# EAGLE design GpsTracker_v1.0 (EAGLE 6.6.0)
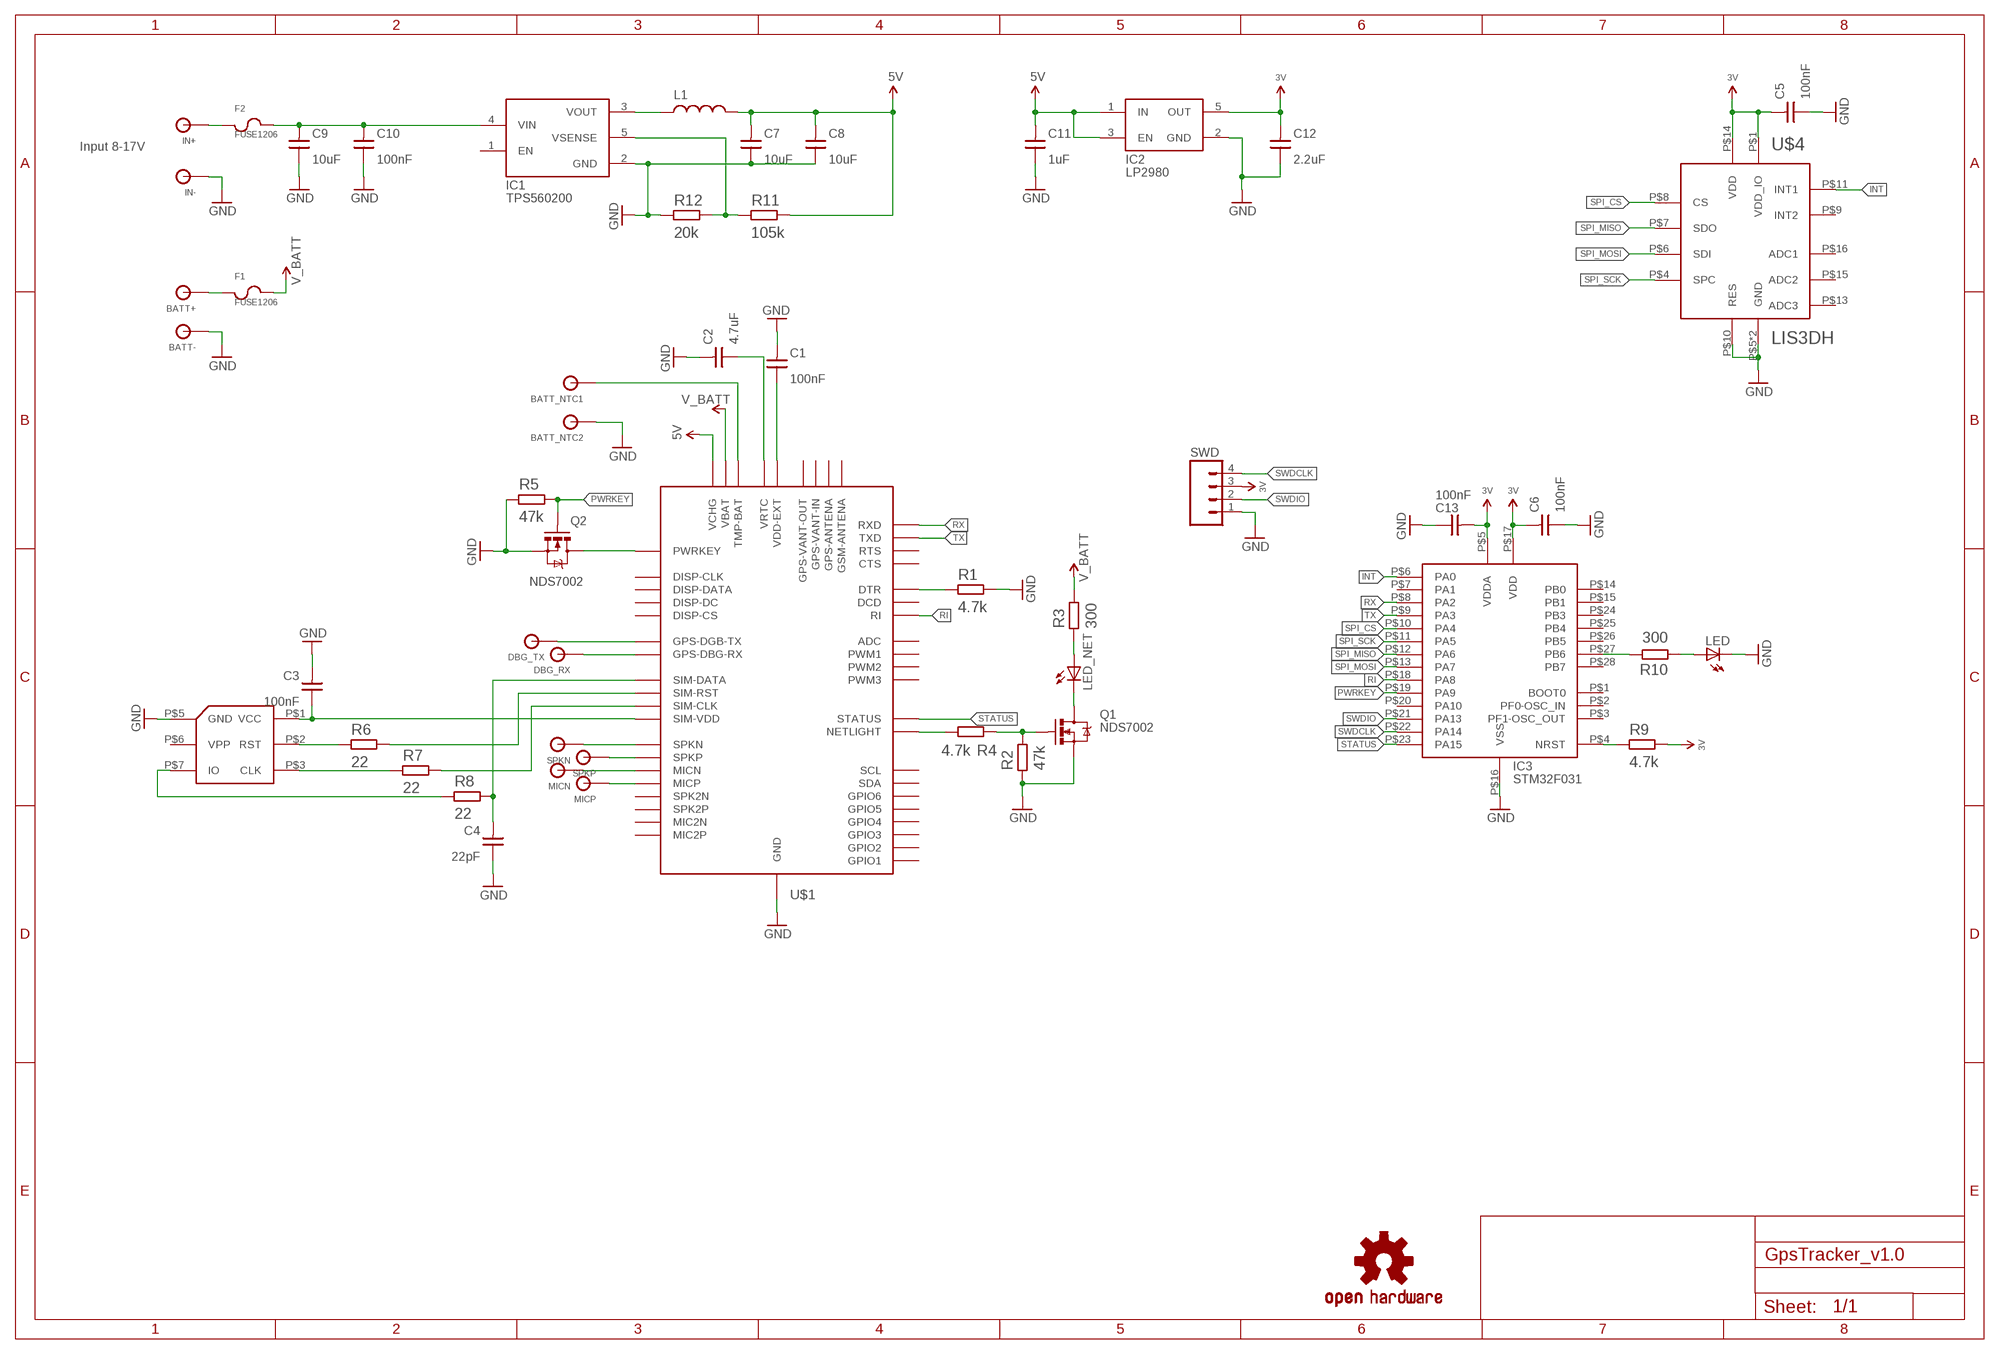
[diagram p0: schematic, sheet 1]

## Parts
BATT+  TEST_POINT_SMD  [TEST_POINT_SMD]
BATT-  TEST_POINT_SMD  [TEST_POINT_SMD]
BATT_NTC1  TEST_POINT_R04  [TP_R04]
BATT_NTC2  TEST_POINT_R04  [TP_R04]
C1  100nF  C0603  [R0603]
C2  4.7uF  C0805  [R0805]
C3  100nF  C0603  [R0603]
C4  22pF  C0603  [R0603]
C5  100nF  C0603  [R0603]
C6  100nF  C0603  [R0603]
C7  10uF  C0805  [R0805]
C8  10uF  C0805  [R0805]
C9  10uF  C1206  [1206]
C10  100nF  C0603  [R0603]
C11  1uF  C0805  [R0805]
C12  2.2uF  C0805  [R0805]
C13  100nF  C0603  [R0603]
DBG_RX  TEST_POINT_R04  [TP_R04]
DBG_TX  TEST_POINT_R04  [TP_R04]
F1  FUSE1206  [1206]
F2  FUSE1206  [1206]
IC1  TPS560200  [SOT23-5L]
IC2  LP2980  [SOT23-5L]
IC3  STM32F031  [UFQFPN28]
IN+  TEST_POINT_SMD  [TEST_POINT_SMD]
IN-  TEST_POINT_SMD  [TEST_POINT_SMD]
L1  LNRG_4026  [NRG_4026]
LED  LED0603  [LED-0603]
LED_NET  LED0603  [LED-0603]
LOGO1  OSHW-LOGOS  [OSHW-LOGO-S]
MICN  TEST_POINT_R04  [TP_R04]
MICP  TEST_POINT_R04  [TP_R04]
Q1  NDS7002  [SOT23]
Q2  NDS7002  [SOT23]
R1  4.7k  R0603  [R0603]
R2  47k  R0603  [R0603]
R3  300  R0603  [R0603]
R4  4.7k  R0603  [R0603]
R5  47k  R0603  [R0603]
R6  22  R0603  [R0603]
R7  22  R0603  [R0603]
R8  22  R0603  [R0603]
R9  4.7k  R0603  [R0603]
R10  300  R0603  [R0603]
R11  105k  R0603  [R0603]
R12  20k  R0603  [R0603]
SPKN  TEST_POINT_R04  [TP_R04]
SPKP  TEST_POINT_R04  [TP_R04]
SWD  M041.27MM  [1X04-1.27MM]
U$1  SIM908  [SIM908]
U$3  SIM_CARD  [SIM_SAMSUNG]
U$4  LIS3DH  [LGA16D]

## Nets
3V: C5.2 C6.2 C12.2 C13.2 IC2.5(OUT) IC3.P$5(VDDA) IC3.P$17(VDD) R9.2 SWD.3 U$4.P$1(VDD_IO) U$4.P$14(VDD)
5V: C7.2 C8.2 C11.2 IC2.1(IN) IC2.3(EN) L1.P$2 R11.2 U$1.VCHG
GND: BATT-.P$1 BATT_NTC2.P$1 C1.2 C2.2 C3.2 C4.1 C5.1 C6.1 C7.1 C8.1 C9.1 C10.1 C11.1 C12.1 C13.1 IC1.2(GND) IC2.2(GND) IC3.P$16(VSS) IN-.P$1 LED.C Q1.2(S) Q2.2(S) R1.2 R2.1 R5.1 R12.1 SWD.1 U$1.GND U$1.GND2(GND) U$1.GND3(GND) U$1.GND4(GND) U$1.GND5(GND) U$1.GND6(GND) U$1.GND7(GND) U$1.GND8(GND) U$1.GND9(GND) U$1.GND10(GND) U$1.GND11(GND) U$1.GND12(GND) U$1.GND13(GND) U$1.GND14(GND) U$1.GND15(GND) U$1.GND16(GND) U$1.GND17(GND) U$1.GND18(GND) U$3.P$5(GND) U$4.P$5(GND) U$4.P$10(RES) U$4.P$12(GND)
INT: IC3.P$6(PA0) U$4.P$11(INT1)
N$1: R1.1 U$1.DTR
N$2: C1.1 U$1.VDD-EXT
N$3: C2.1 U$1.VRTC
N$4: BATT_NTC1.P$1 U$1.TEMP-BAT(TMP-BAT)
N$5: Q1.1(G) R2.2 R4.1
N$6: LED_NET.C Q1.3(D)
N$7: LED_NET.A R3.1
N$8: Q2.3(D) U$1.PWRKEY
N$9: R4.2 U$1.NETLIGHT
N$10: DBG_RX.P$1 U$1.GPS-DBG-RXD(GPS-DBG-RX)
N$11: C3.1 U$1.SIM-VDD U$3.P$1(VCC)
N$12: R6.1 U$3.P$2(RST)
N$13: R7.1 U$3.P$3(CLK)
N$14: R6.2 U$1.SIM-RST
N$15: R7.2 U$1.SIM-CLK
N$16: R8.1 U$3.P$7(IO)
N$17: C4.2 R8.2 U$1.SIM-DATA
N$18: DBG_TX.P$1 U$1.GPS-DBG-TXD(GPS-DGB-TX)
N$19: SPKN.P$1 U$1.SPK1N(SPKN)
N$20: SPKP.P$1 U$1.SPK1P(SPKP)
N$21: MICN.P$1 U$1.MIC1N(MICN)
N$22: MICP.P$1 U$1.MIC1P(MICP)
N$23: BATT+.P$1 F1.1
N$24: IC3.P$4(NRST) R9.1
N$25: IC3.P$27(PB6) R10.2
N$26: LED.A R10.1
N$27: IC1.3(VOUT) L1.P$1
N$28: C9.2 C10.2 F2.2 IC1.4(VIN)
N$29: IC1.5(VSENSE) R11.1 R12.2
N$30: F2.1 IN+.P$1
PWRKEY: IC3.P$19(PA9) Q2.1(G) R5.2
RI: IC3.P$18(PA8) U$1.RI
RX: IC3.P$8(PA2) U$1.RXD
SPI_CS: IC3.P$10(PA4) U$4.P$8(CS)
SPI_MISO: IC3.P$12(PA6) U$4.P$7(SDO)
SPI_MOSI: IC3.P$13(PA7) U$4.P$6(SDI)
SPI_SCK: IC3.P$11(PA5) U$4.P$4(SPC)
STATUS: IC3.P$23(PA15) U$1.STATUS
SWDCLK: IC3.P$22(PA14) SWD.4
SWDIO: IC3.P$21(PA13) SWD.2
TX: IC3.P$9(PA3) U$1.TXD
V_BATT: F1.2 R3.2 U$1.VBAT U$1.VBAT2(VBAT)
Unconnected: IC1.1(EN) IC3.P$1(BOOT0) IC3.P$2(PF0-OSC_IN) IC3.P$3(PF1-OSC_OUT) IC3.P$7(PA1) IC3.P$14(PB0) IC3.P$15(PB1) IC3.P$20(PA10) IC3.P$24(PB3) IC3.P$25(PB4) IC3.P$26(PB5) IC3.P$28(PB7) U$1.ADC U$1.CTS U$1.DCD U$1.DISP-CLK U$1.DISP-CS U$1.DISP-DATA U$1.DISP-DC U$1.GPIO1 U$1.GPIO2 U$1.GPIO3 U$1.GPIO4 U$1.GPIO5 U$1.GPIO6 U$1.GPS-ANTENA U$1.GPS-VANT-IN U$1.GPS-VANT-OUT U$1.GSM-ANTENA U$1.MIC2N U$1.MIC2P U$1.PWM1 U$1.PWM2 U$1.PWM3 U$1.RTS U$1.SCL U$1.SDA U$1.SPK2N U$1.SPK2P U$3.P$6(VPP) U$4.P$9(INT2) U$4.P$13(ADC3) U$4.P$15(ADC2) U$4.P$16(ADC1)

## Notes on the sheet
- Input 8-17V

## Library data of the parts
BATT+ BATT- BATT_NTC1 BATT_NTC2 DBG_RX DBG_TX IN+ IN- MICN MICP SPKN SPKP = 0SBLib:TEST_POINT
C1-C13 = 0SBLib:C
F1 F2 = SparkFun-Passives:FUSE
IC1 = 0SBLib:TPS560200
IC2 = 0SBLib:LP2980
IC3 = 0SBLib:STM32F031: ARM®-based 32-bit MCU with up to 32 Kbytes Flash, timers, ADC and communication interfaces, 2.0-3.6 V
L1 = 0SBLib:L
LED LED_NET = 0SBLib:LED: LEDs Standard schematic elements and footprints for 5mm, 3mm, 1206, and 0603 sized LEDs. 5mm - Spark Fun Electronics SKU : COM-00529 (and others)
LOGO1 = SparkFun-Aesthetics:OSHW-LOGO: Open Source Hardware Logo This logo indicates the piece of hardware it is found on incorporates a OSHW license and/or adheres to the definition of open source hardware found here: http://freedomdefined.org/OSHW
Q1 Q2 = 0SBLib:NDS7002
R1-R12 = 0SBLib:R
SWD = 0SBLib:M04: Header 4 Standard 4-pin 0.1" header. Use with straight break away headers (SKU : PRT-00116), right angle break away headers (PRT-00553), swiss pins (PRT-00743), machine pins (PRT-00117), and female headers (PRT-00115). Molex polarized connector foot print use with SKU : PRT-08231 with associated crimp pins and housings. 1MM SMD Version SKU: PRT-10208
U$1 = 0SBLib:SIM908
U$3 = 0SBLib:SIM_CARD
U$4 = 0SBLib:LIS3DH: MEMS digital output motion sensor ultra low-power high performance 3-axes “nano” accelerometer

## Board
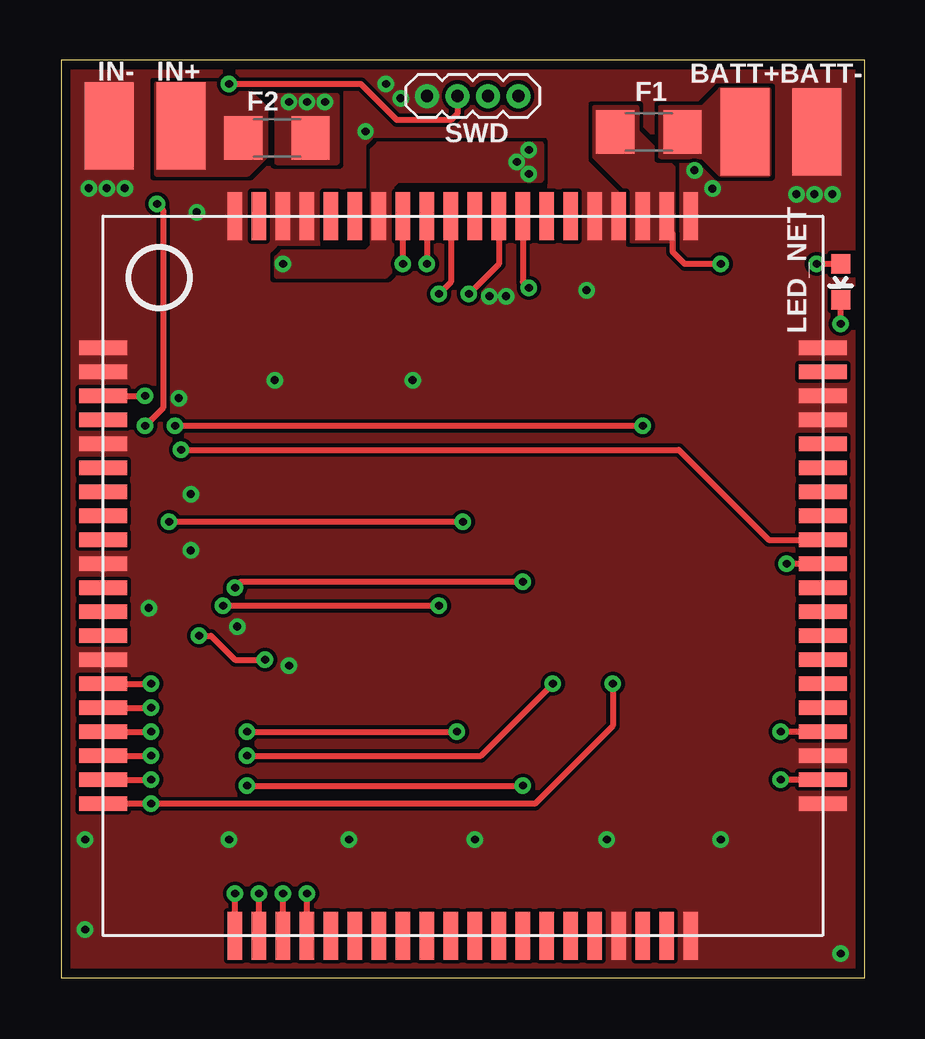
[diagram p1: board, top side]
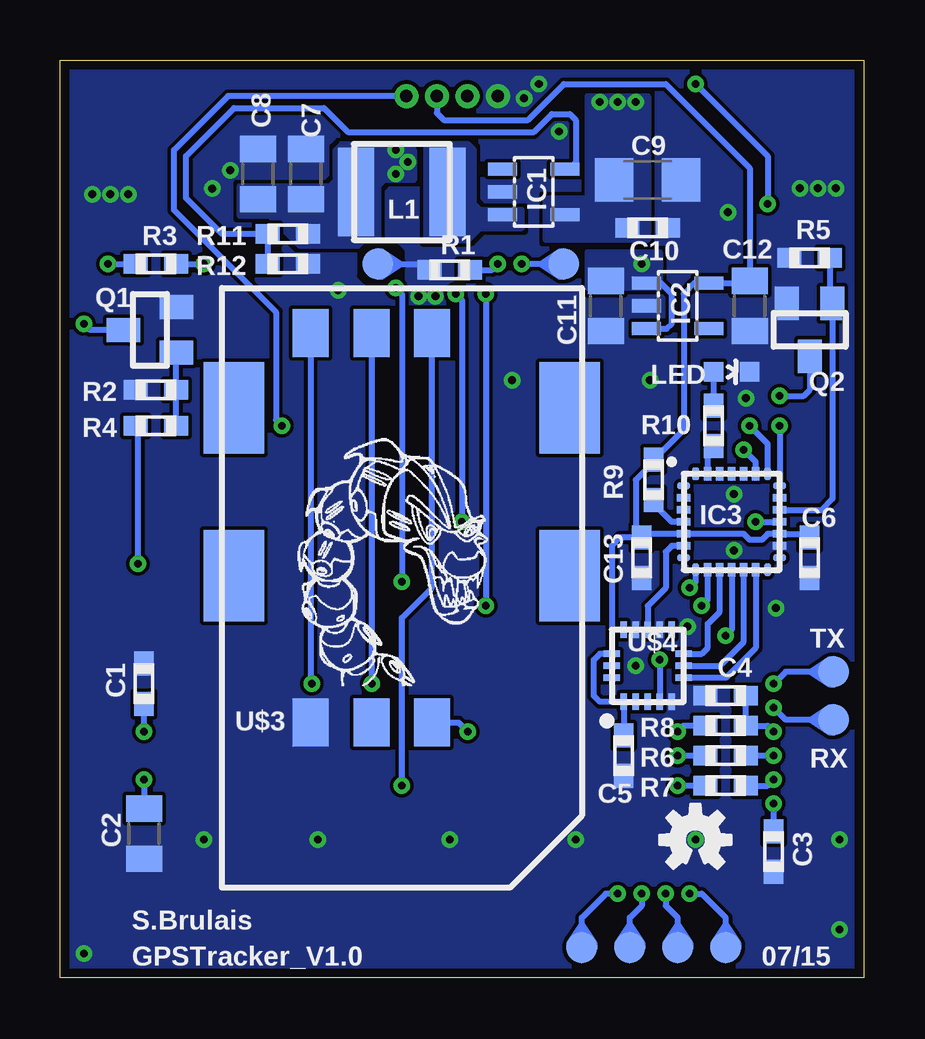
[diagram p2: board, bottom side, seen from below]

Size 33.5 x 38.25 mm. Coordinates in mm from the lower left corner, seen from the top.
Outline: 0,0 33.5,0 33.5,38.25 0,38.25 0,0
Copper layers (1*16): Top 0.0356mm / dielectric 1.5011mm / Bottom 0.0356mm
Design rules "LaenPCBOrder *": minimum track width 6mil, minimum drill 13mil, track to track 6mil, track to pad 6mil, pad to pad 6mil, via to via 6mil, smd to smd 6mil, copper to edge 15mil, drill to drill 6mil, minimum pad ring 7mil, minimum via ring 7mil, stop-mask expansion 3mil, vias tented up to drill 13mil, thermal gap 10mil
bRestrict: area 19.2,29 to 21,30.5

### Footprints (pad centres in the part's own frame; a part is rotated, then mirrored left to right if it is on the bottom)
TEST_POINT_SMD = smd 3.65 x 2.05: P$1 0,0
TP_R04 = smd 1.3 x 1.3: P$1 0,0
R0603 = smd 1 x 0.8: 1 -0.85,0; 2 0.85,0
R0805 = smd 1.1 x 1.5: 1 -1.05,0; 2 1.05,0
1206 = smd 1.6 x 1.8: 1 -1.4,0; 2 1.4,0
SOT23-5L = smd 0.55 x 1.2: 1 -0.95,-1.3; 2 0,-1.3; 3 0.95,-1.3; 4 0.95,1.3; 5 -0.95,1.3
UFQFPN28 = smd 0.55 x 0.3: P$1 -2,1.5; P$2 -2,1; P$3 -2,0.5; P$4 -2,0; P$5 -2,-0.5; P$6 -2,-1; P$7 -2,-1.5; P$15 2,-1.5; P$16 2,-1; P$17 2,-0.5; P$18 2,0; P$19 2,0.5; P$20 2,1; P$21 2,1.5 | smd 0.3 x 0.55: P$8 -1.5,-2; P$9 -1,-2; P$10 -0.5,-2; P$11 0,-2; P$12 0.5,-2; P$13 1,-2; P$14 1.5,-2; P$22 1.5,2; P$23 1,2; P$24 0.5,2; P$25 0,2; P$26 -0.5,2; P$27 -1,2; P$28 -1.5,2
NRG_4026 = smd 1.5 x 3.7: P$1 -1.9,0; P$2 1.9,0
LED-0603 = smd 0.8 x 0.8: A 0,-0.75; C 0,0.75
SOT23 = smd 1 x 1.4: 1 -0.95,-1.1; 2 0.95,-1.1; 3 0,1.1
1X04-1.27MM = drill 0.508 pad 1: 1 0,0; 2 1.27,0; 3 2.54,0; 4 3.81,0
SIM908 = smd 2 x 0.6: ADC 15,-3.5; DISP-CLK -15,4.5; DISP-CS -15,1.5; DISP-DATA -15,3.5; DISP-DC -15,2.5; GND -15,9.5; GND2 -15,8.5; GND3 -15,5.5; GND4 -15,0.5; GND5 -15,-3.5; GND8 15,-9.5; GND9 15,-7.5; GND10 15,6.5; GND11 15,7.5; GND12 15,9.5; GPS-DBG-RXD -15,-5.5; GPS-DBG-TXD -15,-4.5; GSM-ANTENA 15,8.5; NC -15,6.5; NC2 -15,-0.5; NC3 -15,-1.5; NC4 -15,-2.5; NC9 15,-5.5; NC10 15,-4.5; NC11 15,2.5; NC12 15,3.5; NETLIGHT 15,0.5; PWM1 15,-2.5; PWM2 15,-1.5; PWM3 15,-0.5; PWRKEY -15,7.5; SCL 15,4.5; SDA 15,5.5; SIM-CLK -15,-8.5; SIM-DATA -15,-6.5; SIM-RST -15,-7.5; SIM-VDD -15,-9.5; STATUS 15,1.5; VDD-EXT 15,-6.5; VRTC 15,-8.5 | smd 0.6 x 2: CTS 3.5,15; DCD 0.5,15; DTR -1.5,15; GND6 6.5,-15; GND7 9.5,-15; GND13 -9.5,15; GND14 -7.5,15; GND15 -6.5,15; GND16 5.5,15; GND17 6.5,15; GND18 9.5,15; GPIO1 0.5,-15; GPIO2 1.5,-15; GPIO3 2.5,-15; GPIO4 3.5,-15; GPIO5 4.5,-15; GPIO6 5.5,-15; GPS-ANTENA -8.5,15; GPS-VANT-IN -5.5,15; GPS-VANT-OUT -4.5,15; MIC1N -6.5,-15; MIC1P -7.5,-15; MIC2N -2.5,-15; MIC2P -3.5,-15; NC5 -1.5,-15; NC6 -0.5,-15; NC7 7.5,-15; NC8 8.5,-15; RI 1.5,15; RTS 4.5,15; RXD 2.5,15; SPK1N -9.5,-15; SPK1P -8.5,-15; SPK2N -5.5,-15; SPK2P -4.5,-15; TEMP-BAT -2.5,15; TXD -0.5,15; VBAT 8.5,15; VBAT2 7.5,15; VCHG -3.5,15
SIM_SAMSUNG = smd 2.54 x 3.81: MNT1 -7,5; MNT2 7,5; MNT3 -7,-2; MNT4 7,-2 | smd 1.5 x 2: P$1 -3.81,8.12; P$2 -1.27,8.12; P$3 1.27,8.12; P$5 -3.81,-8.12; P$6 -1.27,-8.12; P$7 1.27,-8.12
LGA16D = smd 0.27 x 0.7: P$1 -1,-1.5; P$2 -0.5,-1.5; P$3 0,-1.5; P$4 0.5,-1.5; P$5 1,-1.5; P$9 1,1.5; P$10 0.5,1.5; P$11 0,1.5; P$12 -0.5,1.5; P$13 -1,1.5 | smd 0.7 x 0.27: P$6 1.5,-0.5; P$7 1.5,0; P$8 1.5,0.5; P$14 -1.5,0.5; P$15 -1.5,0; P$16 -1.5,-0.5

### Placement (x,y rotation side)
BATT+  28.5,35.25 270 top
BATT-  31.5,35.25 270 top
BATT_NTC1  12.5,29.75 0 bottom
BATT_NTC2  20.25,29.75 180 bottom
C1  30,12.25 90 bottom
C2  30,6 270 bottom
C3  3.75,5.25 270 bottom
C4  5.75,11.75 0 bottom
C5  10,9.25 90 bottom
C6  2.25,17.5 90 bottom
C7  23.25,33.5 270 bottom
C8  25.25,33.5 270 bottom
C9  9,33.25 180 bottom
C10  9,31.25 180 bottom
C11  10.75,28 90 bottom
C12  4.75,28 90 bottom
C13  9.25,17.5 90 bottom
DBG_RX  1.25,10.75 0 bottom
DBG_TX  1.25,12.75 0 bottom
F1  24.5,35.25 180 top
F2  9,35 0 top
IC1  13.75,32.75 270 bottom
IC2  7.75,28 270 bottom
IC3  5.5,19 0 bottom
IN+  5,35.5 90 top
IN-  2,35.5 90 top
L1  19.25,32.75 180 bottom
LED  5.5,25.25 270 bottom
LED_NET  32.5,29 180 top
LOGO1  7.01,5.74 0 bottom
MICN  11.75,1.25 270 bottom
MICP  9.75,1.25 270 bottom
Q1  29.75,27 90 bottom
Q2  2.25,27 180 bottom
R1  17.25,29.5 180 bottom
R2  29.5,24.5 0 bottom
R3  29.5,29.75 0 bottom
R4  29.5,23 180 bottom
R5  2.25,30 0 bottom
R6  5.75,9.25 0 bottom
R7  5.75,8 0 bottom
R8  5.75,10.5 0 bottom
R9  8.75,20.75 90 bottom
R10  6.25,23 270 bottom
R11  24,31 0 bottom
R12  24,29.75 180 bottom
SPKN  5.75,1.25 270 bottom
SPKP  7.75,1.25 270 bottom
SWD  15.25,36.75 0 top
U$1  16.75,16.75 0 top
U$3  19.25,18.75 0 bottom
U$4  9,13 0 bottom

### Tracks (layer width: path | path; a pad name or v marks a point on that pad's centre or on a via)
3V
  Bottom 0.254: SWD.3 17.79,36.04 17.5,35.75 14,35.75 12.5,37.25 8.25,37.25 4.75,33.75 C12.2 4.85,28.95 IC2.5 7.05,28.95 7.5,28.5 7.5,22.85 R9.2 8.75,21.5 9.5,20.75 9.5,18.6 C13.2 | C13.2 9.1,18.5 IC3.P$5 5,18.5 4.75,18.25 4.25,18.25 4,18.5 IC3.P$17 2.4,18.5 C6.2 | C13.2 10.15,18.35 10.5,18 U$4.P$14 11,13.5 11.25,13.25 11.25,11.75 11,11.5 U$4.P$1 C5.2
5V  (via drill 0.33)
  Bottom 0.254: C11.2 10.75,29.25 | IC2.3 8.2,27.05 8,27.25 8,28.5 8.45,28.95 IC2.1
  other vias: 19.5,34.5 19,34 19.5,33.5 9.25,29.75
  pour Bottom (rank 4, no thermals): 21.75,34.75 19,34.75 18.75,34.5 18.75,33.25 20,33.25 20.25,33 20.25,30.5 23.5,30.5 24.75,31.75 26,31.75 26,33 22.25,33 22,33.25 22,34.5
  pour Top (rank 4, no thermals): 13,30.5 13,34.5 13.25,34.75 20,34.75 20,33.25 14,33.25 13.75,33 13.75,29.5 13.5,29.25 9,29.25 9,30 9.25,30.25 12.75,30.25
  pour Bottom (rank 4, no thermals): 8.5,30.25 8.5,28.75 11.5,28.75 11.5,30.25
GND  (via drill 0.33)
  Bottom 0.254: BATT_NTC2.P$1 18.35,29.75 R1.2
  other vias: 1,2 1,5.75 7,5.75 12,5.75 17.25,5.75 22.75,5.75 27.5,5.75 32.5,1 9.5,13 7.34,14.63 3.65,15.4 5.4,20.15 5.4,17.81 4.9,24.15 8.9,24.9 14.65,24.9 5.65,31.9 1.15,32.9 1.9,32.9 2.65,32.9 30.65,32.65 31.4,32.65 32.15,32.65 13.54,37.25 14.15,36.65 21.9,28.65 17.85,28.4 18.55,28.4 12.69,35.27 26.4,33.65 27.15,32.89
  pour Bottom (rank 6, no thermals): 0,38.25 33.5,38.25 33.5,0 0,0
  pour Top (rank 6, no thermals): 0,38.25 33.5,38.25 33.5,0 0,0
INT
  Bottom 0.254: IC3.P$6 8,18 8.25,17.75 8.25,16.25 9,15.5 U$4.P$11
N$1  (via drill 0.33)
  Top 0.254: U$1.DTR v15.25,29.75
  Bottom 0.254: R1.1 15.5,29.5 v15.25,29.75
N$2  (via drill 0.33)
  Top 0.254: U$1.VDD-EXT v30,10.25
  Bottom 0.254: v30,10.25 C1.1
N$3  (via drill 0.33)
  Top 0.254: U$1.VRTC v30,8.25
  Bottom 0.254: v30,8.25 C2.1
N$4  (via drill 0.33)
  Top 0.254: v14.25,29.75 U$1.TEMP-BAT
  Bottom 0.254: BATT_NTC1.P$1 v14.25,29.75
N$5
  Bottom 0.254: R4.1 R2.2 Q1.1
N$6  (via drill 0.33)
  Top 0.254: v32.5,27.25 LED_NET.C
  Bottom 0.254: Q1.3 32.25,27 v32.5,27.25
N$7  (via drill 0.33)
  Top 0.254: LED_NET.A v31.5,29.75
  Bottom 0.254: v31.5,29.75 R3.1
N$8  (via drill 0.33)
  Top 0.254: U$1.PWRKEY v3.5,24.25
  Bottom 0.254: Q2.3 2.25,24.5 2.5,24.25 v3.5,24.25
N$9  (via drill 0.33)
  Top 0.254: U$1.NETLIGHT v30.25,17.25
  Bottom 0.254: v30.25,17.25 30.25,22.9 R4.2
N$10  (via drill 0.33)
  Top 0.254: U$1.GPS-DBG-RXD v3.75,11.25
  Bottom 0.254: DBG_RX.P$1 3.25,10.75 v3.75,11.25
N$11  (via drill 0.33)
  Top 0.254: v23,12.25 23,10.5 19.75,7.25 v3.75,7.25 U$1.SIM-VDD
  Bottom 0.254: U$3.P$1 23.06,12.31 v23,12.25 | C3.1 v3.75,7.25
N$12  (via drill 0.33)
  Top 0.254: v7.75,9.25 17.5,9.25 v20.5,12.25
  Bottom 0.254: R6.1 v7.75,9.25 | v20.5,12.25 20.5,26.85 U$3.P$2
N$13  (via drill 0.33)
  Top 0.254: v7.75,8 v19.25,8
  Bottom 0.254: R7.1 v7.75,8 | v19.25,8 19.25,15 18,16.25 18,26.85 U$3.P$3
N$14  (via drill 0.33)
  Top 0.254: U$1.SIM-RST v3.75,9.25
  Bottom 0.254: v3.75,9.25 R6.2
N$15  (via drill 0.33)
  Top 0.254: U$1.SIM-CLK v3.75,8.25
  Bottom 0.254: R7.2 4,8 v3.75,8.25
N$16  (via drill 0.33)
  Top 0.254: v7.75,10.25 v16.5,10.25
  Bottom 0.254: R8.1 7.5,10.5 v7.75,10.25 | U$3.P$7 16.88,10.63 v16.5,10.25
N$17  (via drill 0.33)
  Top 0.254: U$1.SIM-DATA v3.75,10.25
  Bottom 0.254: v3.75,10.25 4,10.5 R8.2 C4.2
N$18  (via drill 0.33)
  Top 0.254: U$1.GPS-DBG-TXD v3.75,12.25
  Bottom 0.254: v3.75,12.25 3.25,12.75 DBG_TX.P$1
N$19  (via drill 0.33)
  Top 0.254: U$1.SPK1N v7.25,3.5
  Bottom 0.254: v7.25,3.5 6.75,3.5 5.75,2.5 SPKN.P$1
N$20  (via drill 0.33)
  Top 0.254: U$1.SPK1P v8.25,3.5
  Bottom 0.254: v8.25,3.5 8.25,3 7.75,2.5 SPKP.P$1
N$21  (via drill 0.33)
  Top 0.254: U$1.MIC1N v10.25,3.5
  Bottom 0.254: v10.25,3.5 10.75,3.5 11.75,2.5 MICN.P$1
N$22  (via drill 0.33)
  Top 0.254: U$1.MIC1P v9.25,3.5
  Bottom 0.254: v9.25,3.5 9.25,3 9.75,2.5 MICP.P$1
N$23
  pour Top (rank 3, no thermals): 25,36.25 25,34.25 26.75,34.25 27.5,33.5 29.5,33.5 29.5,37 27.5,37 26.75,36.25
N$24
  Bottom 0.254: IC3.P$4 8,19 8.75,19.75 R9.1
N$25
  Bottom 0.254: IC3.P$27 6.5,21.9 R10.2
N$26
  Bottom 0.254: R10.1 LED.A
N$27
  pour Bottom (rank 4, no thermals): 14.25,32 16,32 16.25,32.25 16.25,34.5 16.5,34.75 18.25,34.75 18.25,30.75 16.5,30.75 16,31.25 14.25,31.25
N$28  (via drill 0.33)
  other vias: 9.5,36.5 10.25,36.5 11,36.5
  pour Top (rank 5, no thermals): 9,36.75 9,34 11.5,34 11.5,36.75
  pour Bottom (rank 4, no thermals): 9,36.75 9,30.75 13.25,30.75 13.25,32.5 11.5,32.5 11.5,36.75
N$29
  Bottom 0.254: R12.2 R11.1 26.75,31 28.25,32.5 28.25,34.25 26.25,36.25 22.5,36.25 21.5,35.25 13.75,35.25 13,36 12.25,36 12,35.75 12,34 12.3,33.7 IC1.5
N$30
  pour Top (rank 4, no thermals): 4,37.25 7.5,37.25 8.5,36.25 8.5,34.25 7.75,33.5 4,33.5
PWRKEY
  Bottom 0.254: R5.2 1.4,28.2 Q2.1 1.3,19.95 1.75,19.5 IC3.P$19
RI  (via drill 0.33)
  Top 0.254: U$1.RI 18.25,29.75 v17,28.5 | v16.75,19 v4.5,19
  Bottom 0.254: v17,28.5 16.75,28.25 v16.75,19 | v4.5,19 IC3.P$18
RX  (via drill 0.33)
  Top 0.254: U$1.RXD 19.25,29 v19.5,28.75 | v19.25,16.5 7.5,16.5 v7.25,16.25
  Bottom 0.254: v19.5,28.75 19.25,28.5 v19.25,16.5 | v7.25,16.25 7,16.5 IC3.P$8
SPI_CS
  Bottom 0.254: U$4.P$8 6.75,13.5 6.5,13.75 6.5,14.75 6,15.25 IC3.P$10
SPI_MISO
  Bottom 0.254: U$4.P$7 6,13 5,14 IC3.P$12
SPI_MOSI
  Bottom 0.254: IC3.P$13 4.5,13.75 5.75,12.5 U$4.P$6
SPI_SCK  (via drill 0.33)
  Top 0.254: v8.5,13.25 7.25,13.25 6.25,14.25 v5.75,14.25
  Bottom 0.254: IC3.P$11 5.5,14.5 v5.75,14.25 | v8.5,13.25 U$4.P$4
STATUS  (via drill 0.33)
  Top 0.254: v5,22 25.75,22 29.5,18.25 U$1.STATUS
  Bottom 0.254: IC3.P$23 4.5,21.5 v5,22
SWDCLK  (via drill 0.33)
  Top 0.254: v24.25,23 v4.75,23
  Bottom 0.254: SWD.4 26.5,36.75 28.75,34.5 28.75,32 24.5,27.75 24.5,23.25 v24.25,23 | IC3.P$22 4,22.25 v4.75,23
SWDIO  (via drill 0.33)
  Top 0.254: SWD.2 16.52,36.02 16.25,35.75 14,35.75 12.5,37.25 v7,37.25 | v4,32.25 4.25,32 4.25,23.75 v3.5,23
  Bottom 0.254: v7,37.25 4,34.25 v4,32.25 | v3.5,23 IC3.P$21
TX  (via drill 0.33)
  Top 0.254: U$1.TXD 16.25,29 v15.75,28.5 | v15.75,15.5 v6.75,15.5
  Bottom 0.254: v15.75,28.5 v15.75,15.5 | v6.75,15.5 6.5,15.75 IC3.P$9
V_BATT  (via drill 0.33)
  Top 0.254: v27.5,29.75 26,29.75 25.5,30.25 25.5,31
  Bottom 0.254: R3.2 v27.5,29.75
  pour Top (rank 4, no thermals): 23.75,32.75 23.75,30.75 25.5,30.75 25.5,33.75 24,35.25 24,36.25 22.25,36.25 22.25,34.25

### Text on the board
bPlace: TX | RX | S.Brulais | 07/15 | GPSTracker_V1.0